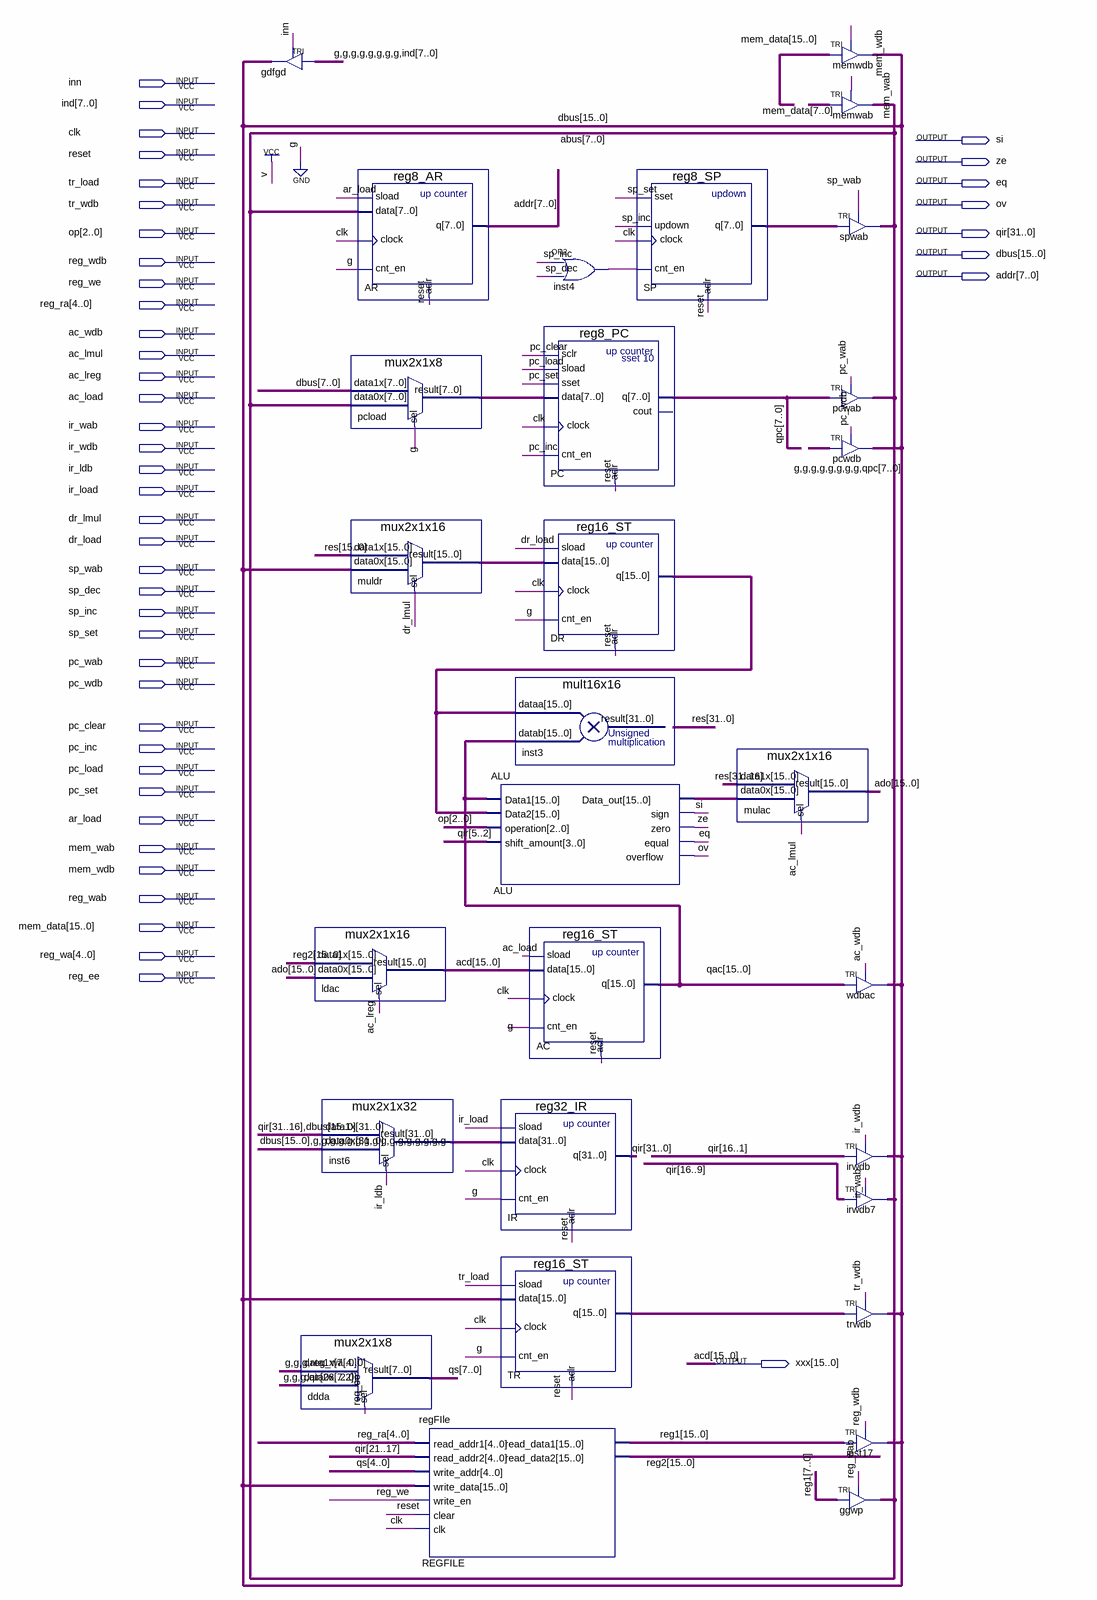
[diagram p0: schematic sheet]
// Quartus schematic DataPath.bdf as structural Verilog: 29 symbols, 45 pins
module DataPath (
  input  inn,
  input  [7:0] ind,
  input  clk,
  input  reset,
  input  tr_load,
  input  tr_wdb,
  input  [2:0] op,
  input  reg_wdb,
  input  reg_we,
  input  [4:0] reg_ra,
  input  ac_wdb,
  input  ac_lmul,
  input  ac_lreg,
  input  ac_load,
  input  ir_wab,
  input  ir_wdb,
  input  ir_ldb,
  input  ir_load,
  input  dr_lmul,
  input  dr_load,
  input  sp_wab,
  input  sp_dec,
  input  sp_inc,
  input  sp_set,
  input  pc_wab,
  input  pc_wdb,
  input  pc_clear,
  input  pc_inc,
  input  pc_load,
  input  pc_set,
  input  ar_load,
  input  mem_wab,
  input  mem_wdb,
  input  reg_wab,
  input  [15:0] mem_data,
  input  [4:0] reg_wa,
  input  reg_ee,
  output si,
  output ze,
  output eq,
  output ov,
  output [31:0] qir,
  output [15:0] dbus,
  output [7:0] addr,
  output [15:0] xxx
);

  wire inst4_out;
  wire [7:0] abus, pcload_result, qpc, qs, SP_q;
  wire [15:0] ado, ALU_data_out, DR_q, muldr_result, qac, reg1, reg2, TR_q;
  wire [31:0] inst6_result, res;

  TRI gdfgd[15:0] (.IN({{8{1'b0}}, ind}), .OE(inn), .OUT(dbus));
  mux2x1x16 ldac (.data1x(reg2), .data0x(ado), .sel(ac_lreg), .result(xxx));
  mux2x1x32 inst6 (.data1x({qir[31:16], dbus}), .data0x({dbus, {16{1'b0}}}), .sel(ir_ldb), .result(inst6_result));
  mux2x1x8 ddda (.data1x({3'b000, reg_wa}), .data0x({3'b000, qir[26:22]}), .sel(reg_ee), .result(qs));
  reg8_AR AR (.sload(ar_load), .data(abus), .clock(clk), .cnt_en(1'b0), .aclr(reset), .q(addr));
  mux2x1x8 pcload (.data1x(dbus[7:0]), .data0x(abus), .sel(1'b0), .result(pcload_result));
  mux2x1x16 muldr (.data1x(res[15:0]), .data0x(dbus), .sel(dr_lmul), .result(muldr_result));
  regFIle REGFILE (
    .read_addr1(reg_ra), .read_addr2(qir[21:17]), .write_addr(qs[4:0]), .write_data(dbus), .write_en(reg_we),
    .clear(reset), .clk(clk), .read_data1(reg1), .read_data2(reg2));
  ALU ALU (
    .Data1(qac), .Data2(DR_q), .operation(op), .shift_amount(qir[5:2]), .Data_out(ALU_data_out), .sign(si),
    .zero(ze), .equal(eq), .overflow(ov));
  reg32_IR IR (.sload(ir_load), .data(inst6_result), .clock(clk), .cnt_en(1'b0), .aclr(reset), .q(qir));
  reg16_ST TR (.sload(tr_load), .data(dbus), .clock(clk), .cnt_en(1'b0), .aclr(reset), .q(TR_q));
  or inst4 (inst4_out, sp_inc, sp_dec);
  reg8_PC PC (
    .sclr(pc_clear), .sload(pc_load), .data(pcload_result), .sset(pc_set), .clock(clk), .cnt_en(pc_inc),
    .aclr(reset), .q(qpc));  // open: cout
  reg16_ST DR (.sload(dr_load), .data(muldr_result), .clock(clk), .cnt_en(1'b0), .aclr(reset), .q(DR_q));
  mult16x16 inst3 (.dataa(DR_q), .datab(qac), .result(res));
  reg16_ST AC (.sload(ac_load), .data(xxx), .clock(clk), .cnt_en(1'b0), .aclr(reset), .q(qac));
  reg8_SP SP (.sset(sp_set), .updown(sp_inc), .clock(clk), .cnt_en(inst4_out), .aclr(reset), .q(SP_q));
  mux2x1x16 mulac (.data1x(res[31:16]), .data0x(ALU_data_out), .sel(ac_lmul), .result(ado));
  TRI memwdb[15:0] (.IN(mem_data), .OE(mem_wdb), .OUT(dbus));
  TRI memwab[7:0] (.IN(mem_data[7:0]), .OE(mem_wab), .OUT(abus));
  TRI spwab[7:0] (.IN(SP_q), .OE(sp_wab), .OUT(abus));
  TRI pcwab[7:0] (.IN(qpc), .OE(pc_wab), .OUT(abus));
  TRI pcwdb[15:0] (.IN({{8{1'b0}}, qpc}), .OE(pc_wdb), .OUT(dbus));
  TRI wdbac[15:0] (.IN(qac), .OE(ac_wdb), .OUT(dbus));
  TRI irwdb[15:0] (.IN(qir[16:1]), .OE(ir_wdb), .OUT(dbus));
  TRI irwdb7[7:0] (.IN(qir[16:9]), .OE(ir_wab), .OUT(abus));
  TRI trwdb[15:0] (.IN(TR_q), .OE(tr_wdb), .OUT(dbus));
  TRI inst17[15:0] (.IN(reg1), .OE(reg_wdb), .OUT(dbus));
  TRI ggwp[7:0] (.IN(reg1[7:0]), .OE(reg_wab), .OUT(abus));

  // Other names for the same wires on the sheet: acd[15:0] = xxx
endmodule
